# EAGLE schematic CAN-BUS-UART_v1 (EAGLE 6.3)
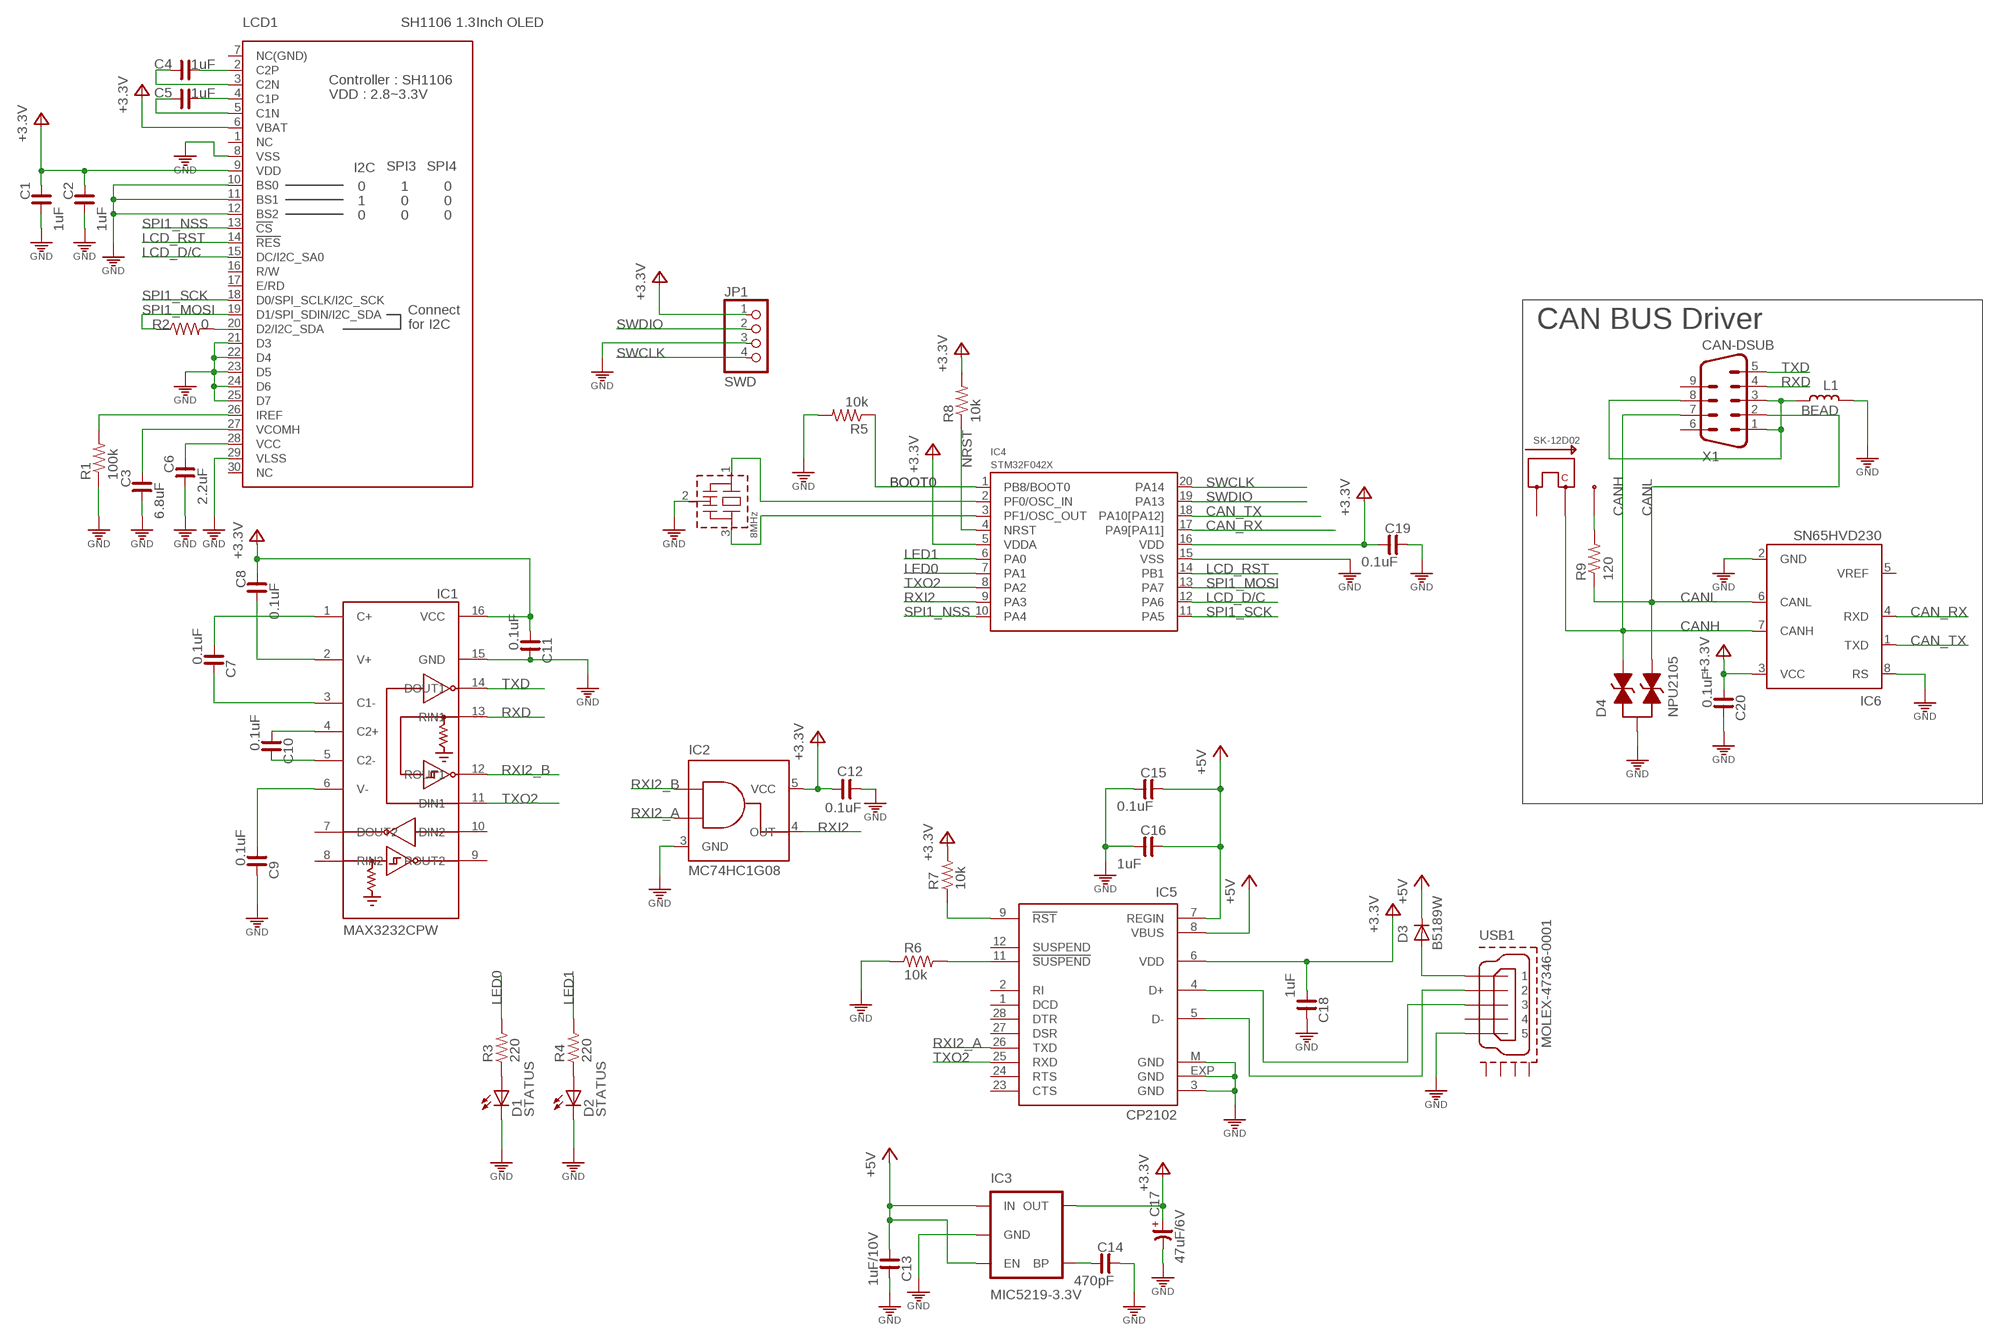
[diagram p0: schematic, sheet 1]

## Parts
C1  1uF  C_0603  [C0603]
C2  1uF  C_0603  [C0603]
C3  6.8uF  C_0805  [C0805]
C4  1uF  C_0603  [C0603]
C5  1uF  C_0603  [C0603]
C6  2.2uF  C_0805  [C0805]
C7  0.1uF  C_0603  [C0603]
C8  0.1uF  C_0603  [C0603]
C9  0.1uF  C_0603  [C0603]
C10  0.1uF  C_0603  [C0603]
C11  0.1uF  C_0603  [C0603]
C12  0.1uF  C_0603  [C0603]
C13  1uF/10V  C_0603  [C0603]
C14  470pF  C_0603  [C0603]
C15  0.1uF  C_0603  [C0603]
C16  1uF  C_0603  [C0603]
C17  47uF/6V  CP_3528-21  [C3528-21/T]
C18  1uF  C_0603  [C0603]
C19  0.1uF  C_0603  [C0603]
C20  0.1uF  C_0603  [C0603]
D1  STATUS  LED3FG2HD-T1  [3FG2HD-T1]
D2  STATUS  LED3FG2HD-T1  [3FG2HD-T1]
D3  B5189W  B5189WN  [SOD323]
D4  NPU2105  [SOT23]
IC1  MAX3232CPW  MAX3232MAX232CPW  [PW_R-PDSO-G16]
IC2  MC74HC1G08  AND_GATE_2INMC74HC1G08  [SOT23-5L_MC74HC1G08]
IC3  MIC5219-3.3V  V_REG_LDOSMD  [SOT23-5]
IC4  STM32F042X  [TSSOP20]
IC5  CP2102  [MLP28]
IC6  SN65HVD230  PCA82C250T  [SO8]
JP1  SWD  PINHD-1X4M  [1X04M]
L1  BEAD  L_0805  [L0805]
LCD1  SH1106 1.3Inch OLED  SH1106_1.3_OLEDBUTTOM  [SH1106_1.3OLED_BUTTOM]
Q1  8MHz  X-TAL-SMALLCSTCE16M00V53  [CSTLA_X]
R1  100k  R-US_R1608  [R0603@1]
R2  0  R-US_R1608  [R0603@1]
R3  220  R_0603  [R0603]
R4  220  R_0603  [R0603]
R5  10k  R-US_R1608  [R0603@1]
R6  10k  R_0603  [R0603]
R7  10k  R_0603  [R0603]
R8  10k  R-US_R1608  [R0603@1]
R9  120  R-US_R1608  [R0603@1]
SW1  SK-12D02  SW_2PSK-12D02  [SK-12DO2]
USB1  MOLEX-47346-0001  [MOLEX-47364-0001]
X1  CAN-DSUB  M09KR  [M09H-1]

## Nets
3V3: C1.1 C2.1 C8.1 C11.2 C12.2 C17.+ C18.2 C19.2 C20.2 IC1.16(VCC) IC2.5(VCC) IC3.5(OUT) IC4.5(VDDA) IC4.16(VDD) IC5.6(VDD) IC6.3(VCC) JP1.1 LCD1.6(VBAT) LCD1.9(VDD) R7.2 R8.2 ; supply symbol labelled +3V3
+5V: C13.2 C15.1 C16.1 D3.C IC3.1(IN) IC3.3(EN) IC5.7(REGIN) IC5.8(VBUS)
BOOT0: IC4.1(PB8/BOOT0) R5.1
CAN_RX: IC4.17(PA9[PA11]) IC6.4(RXD)
CAN_TX: IC4.18(PA10[PA12]) IC6.1(TXD)
CANH: D4.G(PIN1) IC6.7(CANH) SW1.C X1.7
CANL: D4.S(PIN2) IC6.6(CANL) R9.1 X1.2
GND: C1.2 C2.2 C3.2 C6.2 C9.1 C11.1 C12.1 C13.1 C14.1 C15.2 C16.2 C17.- C18.1 C19.1 C20.1 D1.K(C) D2.K(C) D4.D(PIN3) IC1.15(GND) IC2.3(GND) IC3.2(GND) IC4.15(VSS) IC5.3(GND) IC5.EXP(GND) IC5.M(GND) IC6.2(GND) IC6.8(RS) JP1.3 L1.2 LCD1.8(VSS) LCD1.10(BS0) LCD1.11(BS1) LCD1.12(BS2) LCD1.21(D3) LCD1.22(D4) LCD1.23(D5) LCD1.24(D6) LCD1.25(D7) LCD1.29(VLSS) Q1.2(GND) R1.1 R5.2 R6.1 USB1.5
LCD_D/C: IC4.12(PA6) LCD1.15(DC/I2C_SA0)
LCD_RST: IC4.14(PB1) LCD1.14(!RES)
LED0: IC4.7(PA1) R3.2
LED1: IC4.6(PA0) R4.2
N$1: IC5.9(!RST) R7.1
N$2: IC4.2(PF0/OSC_IN) Q1.1(IN)
N$3: IC4.3(PF1/OSC_OUT) Q1.3(OUT)
N$4: D3.A USB1.1
N$5: R9.2 SW1.3
N$6: LCD1.26(IREF) R1.2
N$7: D1.A R3.1
N$8: IC5.5(D-) USB1.2
N$9 [GND]: L1.1 X1.1 X1.3 X1.8
N$10: C14.2 IC3.4(BP)
N$14: C10.1 IC1.5(C2-)
N$15: C4.2 LCD1.2(C2P)
N$16: C4.1 LCD1.3(C2N)
N$17: C5.2 LCD1.4(C1P)
N$18: C5.1 LCD1.5(C1N)
N$19: LCD1.20(D2/I2C_SDA) R2.2
N$20: IC5.4(D+) USB1.3
N$21: C3.1 LCD1.27(VCOMH)
N$22: C6.1 LCD1.28(VCC)
N$23: IC5.11(!SUSPEND) R6.2
N$25: C10.2 IC1.4(C2+)
N$26: C9.2 IC1.6(V-)
N$27: C7.2 IC1.1(C+)
N$29: C7.1 IC1.3(C1-)
N$31: C8.2 IC1.2(V+)
N$39: D2.A R4.1
NRST: IC4.4(NRST) R8.1
RXD: IC1.13(RIN1) X1.4
RXI2: IC2.4(OUT) IC4.9(PA3)
RXI2_A: IC2.2(INA) IC5.26(TXD)
RXI2_B: IC1.12(ROUT1) IC2.1(INB)
SPI1_MOSI: IC4.13(PA7) LCD1.19(D1/SPI_SDIN/I2C_SDA) R2.1
SPI1_NSS: IC4.10(PA4) LCD1.13(!CS)
SPI1_SCK: IC4.11(PA5) LCD1.18(D0/SPI_SCLK/I2C_SCK)
SWCLK: IC4.20(PA14) JP1.4
SWDIO: IC4.19(PA13) JP1.2
TXD: IC1.14(DOUT1) X1.5
TXO2: IC1.11(DIN1) IC4.8(PA2) IC5.25(RXD)
Unconnected: IC1.7(DOUT2) IC1.8(RIN2) IC1.9(ROUT2) IC1.10(DIN2) IC5.1(DCD) IC5.2(RI) IC5.12(SUSPEND) IC5.23(CTS) IC5.24(RTS) IC5.27(DSR) IC5.28(DTR) IC6.5(VREF) LCD1.1(NC) LCD1.7(NC(GND)) LCD1.16(R/W) LCD1.17(E/RD) LCD1.30(NC) SW1.1 USB1.4 USB1.GND1 USB1.GND2 USB1.GND3 USB1.GND4 X1.6 X1.9

## Notes on the sheet
- CAN BUS Driver

## Library data of the parts
C1-C16 C18-C20 = cona_lib:C_: NON-POLARIZED CAP
C17 = rc-master-smd:CP_: POLARIZED CAP
D1 D2 = cona_lib:LED: LED OSRAM: - CHIPLED LG R971, LG N971, LY N971, LG Q971, LY Q971, LO R971, LY R971 LH N974, LH R974 LS Q976, LO Q976, LY Q976 LO Q996 - Hyper CHIPLED LW Q18S LB Q993, LB Q99A, LB R99A - SideLED LS A670, LO A670, LY A670, LG A670, LP A670 LB A673, LV A673, LT A673, LW A673 LH A674 LY A675 LS A676, LA A676, LO A676, LY A676, LW A676 LS A679, LY A679, LG A679 - Hyper Micro SIDELED® LS Y876, LA Y876, LO Y876, LY Y876 LT Y87S - SmartLED LW L88C, LW L88S LB L89C, LB L89S, LG L890 LS L89K, LO L89K, LY L89K LS L896, LA L896, LO L896, LY L896 - TOPLED LS T670, LO T670, LY T670, LG T670, LP T670 LSG T670, LSP T670, LSY T670, LOP T670, LYG T670 LG T671, LOG T671, LSG T671 LB T673, LV T673, LT T673, LW T673 LH T674 LS T676, LA T676, LO T676, LY T676, LB T676, LH T676, LSB T676, LW T676 LB T67C, LV T67C, LT T67C, LS T67K, LO T67K, LY T67K, LW E67C LS E67B, LA E67B, LO E67B, LY E67B, LB E67C, LV E67C, LT E67C LW T67C LS T679, LY T679, LG T679 LS T770, LO T770, LY T770, LG T770, LP T770 LB T773, LV T773, LT T773, LW T773 LH T774 LS E675, LA E675, LY E675, LS T675 LS T776, LA T776, LO T776, LY T776, LB T776 LHGB T686 LT T68C, LB T68C - Hyper Mini TOPLED® LB M676 - Mini TOPLED Santana® LG M470 LS M47K, LO M47K, LY M47K Source: http://www.osram.convergy.de LUXEON: - LUMILED® LXK2-PW12-R00, LXK2-PW12-S00, LXK2-PW14-U00, LXK2-PW14-V00 LXK2-PM12-R00, LXK2-PM12-S00, LXK2-PM14-U00 LXK2-PE12-Q00, LXK2-PE12-R00, LXK2-PE12-S00, LXK2-PE14-T00, LXK2-PE14-U00 LXK2-PB12-K00, LXK2-PB12-L00, LXK2-PB12-M00, LXK2-PB14-N00, LXK2-PB14-P00, LXK2-PB14-Q00 LXK2-PR12-L00, LXK2-PR12-M00, LXK2-PR14-Q00, LXK2-PR14-R00 LXK2-PD12-Q00, LXK2-PD12-R00, LXK2-PD12-S00 LXK2-PH12-R00, LXK2-PH12-S00 LXK2-PL12-P00, LXK2-PL12-Q00, LXK2-PL12-R00 Source: www.luxeon.com KINGBRIGHT: KA-3528ASYC Source: www.kingbright.com
D3 = cona_lib:B5189W
D4 = cona_lib:NPU2105
IC1 = cona_lib:MAX3232: TI
IC2 = cona_lib:AND_GATE_2IN: MC74HC1G08 CMOS 2 input AND gate
IC3 = SparkFun:V_REG_LDO: Voltage Regulator LDO Standard 150mA LDO voltage regulator in SOT-23 layout. Micrel part MIC5205. BP (by-pass) pin is used to lower output noise with 470pF cap.
IC4 = stm32:STM32F042X
IC5 = silabs:CP210*: Single-Chip USB to UART Bridge Source: www.silabs.com .. CP2101.pdf / cp2102.pdf; MF: FARNELL; MPN: CP2102-GM; OC_FARNELL: 9282130; OC_NEWARK: 30K5635
IC6 = cona_lib:PCA82C250: CAN CONTROLLER INTERFACE
JP1 = pinhead:PINHD-1X4: PIN HEADER
L1 = cona_lib:L_: INDUCTOR
LCD1 = OLED_Display:SH1106_1.3_OLED
Q1 = cona_lib:X-TAL-SMALL: Ceramic Resonators MuRata CSTCE08MOOG52A
R1 R2 R5 R8 R9 = cona_lib:R-US_: RESISTOR, American symbol
R3 R4 R6 R7 = cona_lib:R_: RESISTOR
SW1 = cona_lib:SW_2P
USB1 = usb_con-update:MOLEX-47346-0001: MICRO USB B, BOTTOM MOUNT
X1 = con-subd:M09: SUB-D

## Net classes
0 default: clearance 0.2 mm
2 GND: width 0.2 mm, clearance 0.152 mm